# Altium schematic sheet Peripherals.SchDoc
size Letter; SheetNumber: 3; SheetTotal: 3
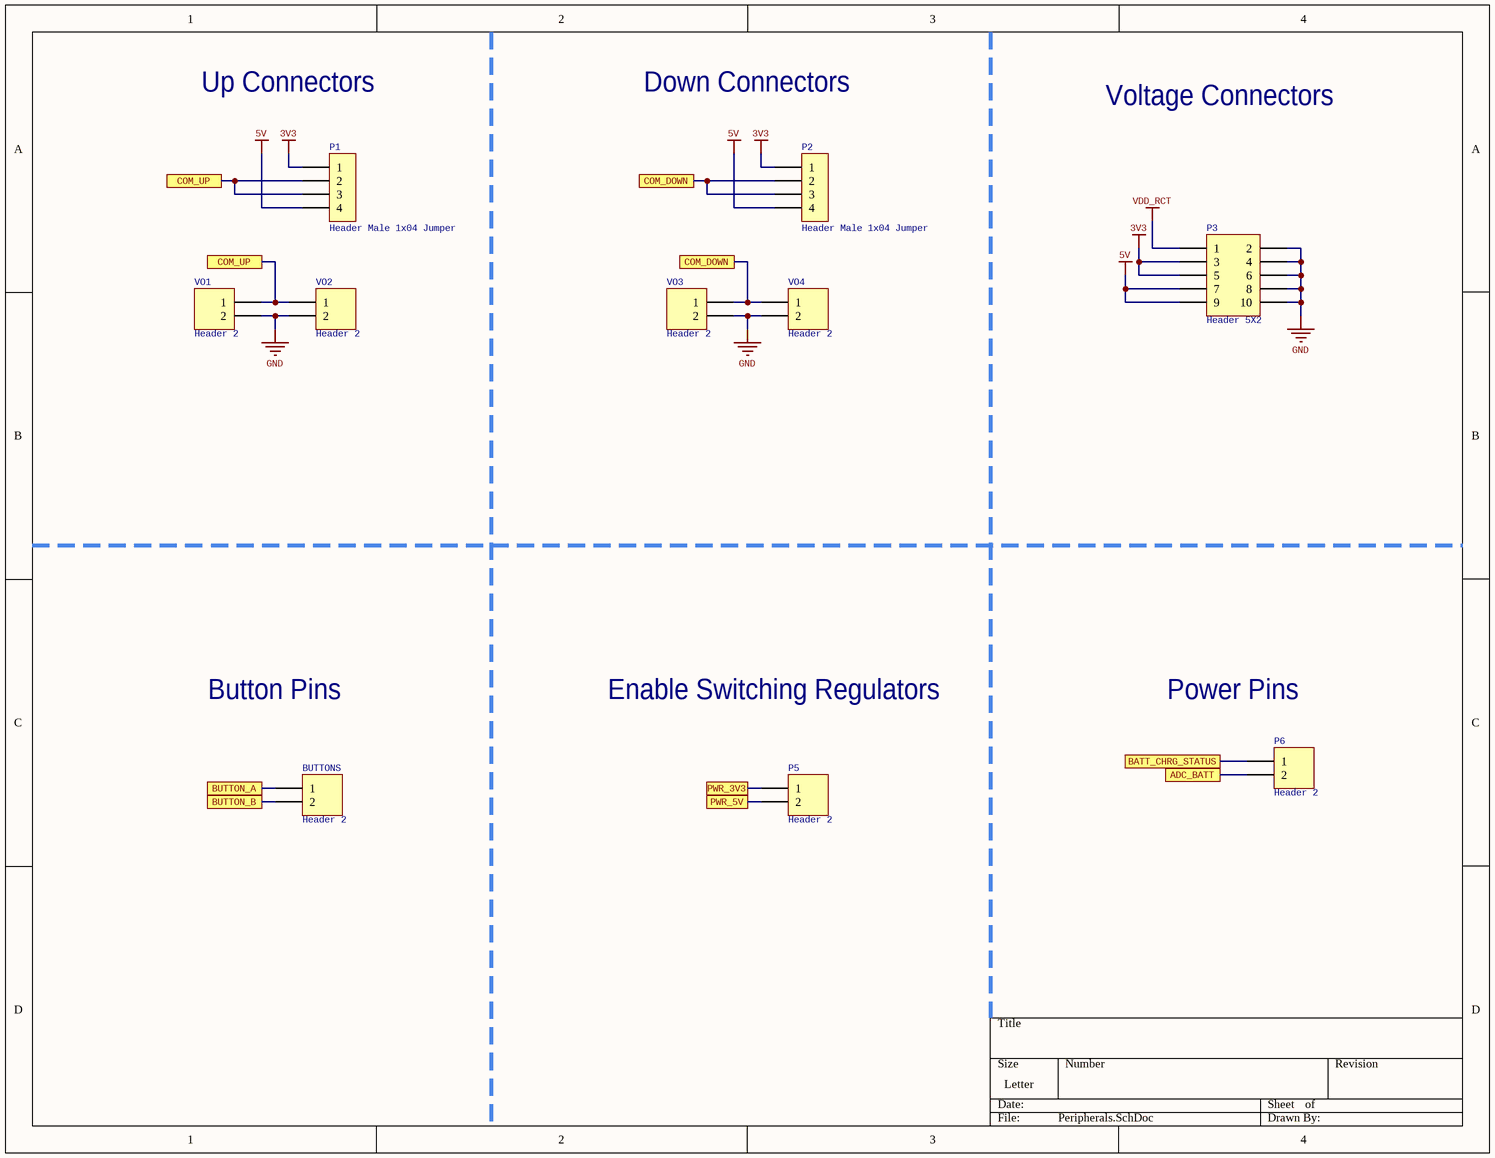
[diagram p0: Peripherals.SchDoc]

## Parts
BUTTONS  Header 2  [HDR1X2]  (no BOM)
P1  Header Male 1x04 Jumper  [Header 1x04 Jumper]  (no BOM)
P2  Header Male 1x04 Jumper  [Header 1x04 Jumper]  (no BOM)
P3  Header 5X2  [HDR2X5]  (no BOM)
P5  Header 2  [HDR1X2]  (no BOM)
P6  Header 2  [HDR1X2]  (no BOM)
VO1  Header 2  [HDR1X2]  (no BOM)
VO2  Header 2  [HDR1X2]  (no BOM)
VO3  Header 2  [HDR1X2]  (no BOM)
VO4  Header 2  [HDR1X2]  (no BOM)

## Ports
ADC_BATT (see PowerSchematic[1D]), BATT_CHRG_STATUS (see PowerSchematic[3D]), BUTTON_A (see PowerSchematic[3B], PowerSchematic[4C]), BUTTON_B (see PowerSchematic[4B], PowerSchematic[4D]), COM_DOWN (see Peripherals[2A]), COM_UP (see Peripherals[1A]), PWR_3V3 (see SwitchingRegulators[3B]), PWR_5V (see SwitchingRegulators[3B])

## Nets
3V3: P1.1 P2.1 P3.3 P3.5
5V: P1.4 P2.4 P3.7 P3.9
GND: P3.2 P3.4 P3.6 P3.8 P3.10 VO1.2 VO2.2 VO3.2 VO4.2
VDD_RCT: P3.1
ADC_BATT: P6.2 ; port ADC_BATT
BATT_CHRG_STATUS: P6.1 ; port BATT_CHRG_STATUS
BUTTON_A: BUTTONS.1 ; port BUTTON_A
BUTTON_B: BUTTONS.2 ; port BUTTON_B
COM_DOWN: P2.2 P2.3 VO3.1 VO4.1 ; port COM_DOWN
COM_UP: P1.2 P1.3 VO1.1 VO2.1 ; port COM_UP
PWR_3V3: P5.1 ; port PWR_3V3
PWR_5V: P5.2 ; port PWR_5V

## Notes on the sheet
- Up Connectors
- Down Connectors
- Voltage Connectors
- Button Pins
- Enable Switching Regulators
- Power Pins

## Library data of the parts
BUTTONS P5 P6 VO1-VO4 = Header 2: Header, 2-Pin; LatestRevisionDate: 17-Jul-2002; LatestRevisionNote: Re-released for DXP Platform.; Publisher: Altium Limited
P1 P2 = Header Male Jumper 1x04
P3 = Header 5X2: Header, 5-Pin, Dual row; LatestRevisionDate: 17-Jul-2002; LatestRevisionNote: Re-released for DXP Platform.; Publisher: Altium Limited